# Altium project Word_Two.PrjPcb
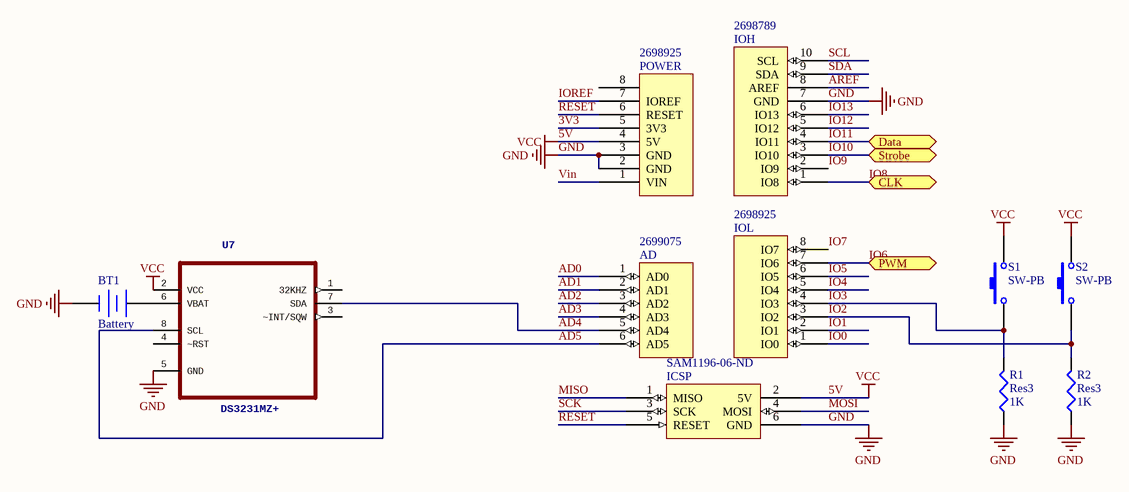
[diagram p0: ArduinoUnoShield.SchDoc]
2 sheets, 17 parts. Net scope: flat (ports and power ports of the same name join across sheets).
Board file: ArduinoUnoShield.PcbDoc
Sheets:
  ArduinoUnoShield.SchDoc
  Clock.SchDoc

## Sheet ArduinoUnoShield.SchDoc
size A4

### Parts
AD  Supplier Part Number 4: 2699075  [Header 6x1 8.5mm]  (hidden comment: AD)
BT1  Battery  [BAT-2]
ICSP  Supplier Part Number 5: SAM1196-06-ND  [ICSP]  (hidden comment: ICSP)
IOH  Supplier Part Number 3: 2698789  [Header 10x1 8.5mm]  (hidden comment: IOH)
IOL  Supplier Part Number 4: 2698925  [Header 8x1 8.5mm]  (hidden comment: IOL)
POWER  Supplier Part Number 4: 2698925  [Header 8x1 8.5mm]  (hidden comment: POWER_UNO)
R1  Res3  value 1K  [J1-0603]
R2  Res3  value 1K  [J1-0603]
S1  SW-PB  [SPST-2]
S2  SW-PB  [SPST-2]
U7  DS3231MZ+  [SOIC8_150MIL]

### Ports
CLK, Data, PWM, Strobe

### Nets
5V: ICSP.2(5V) POWER.4(5V) S1.2 S2.2 U7.2(VCC)  [also labelled VCC]
GND: BT1.2(-) ICSP.6(GND) IOH.7(GND) POWER.2(GND) POWER.3(GND) R1.1 R2.1 U7.5(GND)
3V3: POWER.5(3V3)
AD0: AD.1(AD0)
AD1: AD.2(AD1)
AD2: AD.3(AD2)
AD3: AD.4(AD3)
AD4: AD.5(AD4) U7.7(SDA)
AD5: AD.6(AD5) U7.8(SCL)
AREF: IOH.8(AREF)
IO0: IOL.1(IO0)
IO1: IOL.2(IO1)
IO2: IOL.3(IO2) R2.2 S2.1
IO3: IOL.4(IO3) R1.2 S1.1
IO4: IOL.5(IO4)
IO5: IOL.6(IO5)
IO6: IOL.7(IO6) ; port PWM
IO7: IOL.8(IO7)
IO8: IOH.1(IO8) ; port CLK
IO9: IOH.2(IO9)
IO10: IOH.3(IO10) ; port Strobe
IO11: IOH.4(IO11) ; port Data
IO12: IOH.5(IO12)
IO13: IOH.6(IO13)
IOREF: POWER.7(IOREF)
MISO: ICSP.1(MISO)
MOSI: ICSP.4(MOSI)
RESET: ICSP.5(RESET) POWER.6(RESET)
SCK: ICSP.3(SCK)
SCL: IOH.10(SCL)
SDA: IOH.9(SDA)
Vin: POWER.1(VIN)
NetBT1_1: BT1.1(+) U7.6(VBAT)

Not connected (* = marked no-connect by the designer): POWER 8; U7 1(32KHZ) 3(~INT/SQW) 4(~RST)

### Library data of the parts
BT1 = Battery: Multicell Battery; Published: 24-Mar-1999; LatestRevisionDate: 17-Jul-2002; LatestRevisionNote: Re-released for DXP Platform.; PackageReference: BAT-2; Publisher: Altium Limited; PackageDescription: Battery; 2 Leads
R1 R2 = Res3: Resistor; Published: 8-Jun-2000; LatestRevisionDate: 29-May-2009; LatestRevisionNote: IPC-7351 Footprint Added.; PackageReference: J1-0603; Publisher: Altium Limited; PackageDescription: Chip Resistor
S1 S2 = SW-PB: Switch; Published: 24-Mar-1999; LatestRevisionDate: 17-Jul-2002; LatestRevisionNote: Re-released for DXP Platform.; PackageReference: SPST-2; Publisher: Altium Limited; PackageDescription: Switch; 2 Leads
U7 = DS3231MZ+: MF: Maxim Integrated; Availability: Good; Package: SOIC-8 Maxim Integrated; Price: 5.38 USD; MP: DS3231MZ+
AD = AD: Supplier 1: Arrow; Supplier Part Number 1: 2699089; Supplier 2: Digi-Key; Supplier Part Number 2: SAM1198-06-ND; Supplier 3: Arrow; Supplier Part Number 3: 2699088; Supplier 4: Arrow
ICSP = ICSP: Supplier 1: Arrow; Supplier Part Number 1: 2699117; Supplier 2: Arrow; Supplier Part Number 2: 2699116; Supplier 3: Digi-Key; Supplier Part Number 3: SAM1185-06-ND; Supplier 4: Arrow; Supplier Part Number 4: 2699091; Supplier 5: Digi-Key
IOH = IOH: Supplier 1: Arrow; Supplier Part Number 1: 2698803S4475693N1004; Supplier 2: Digi-Key; Supplier Part Number 2: SAM1198-10-ND; Supplier 3: Arrow
IOL = IOL: Supplier 1: Digi-Key; Supplier Part Number 1: SAM1198-08-ND; Supplier 2: Arrow; Supplier Part Number 2: 2698939; Supplier 3: Arrow; Supplier Part Number 3: 2698940; Supplier 4: Arrow
POWER = POWER_UNO: Supplier 1: Digi-Key; Supplier Part Number 1: SAM1198-08-ND; Supplier 2: Arrow; Supplier Part Number 2: 2698939; Supplier 3: Arrow; Supplier Part Number 3: 2698940; Supplier 4: Arrow

## Sheet Clock.SchDoc
size A4
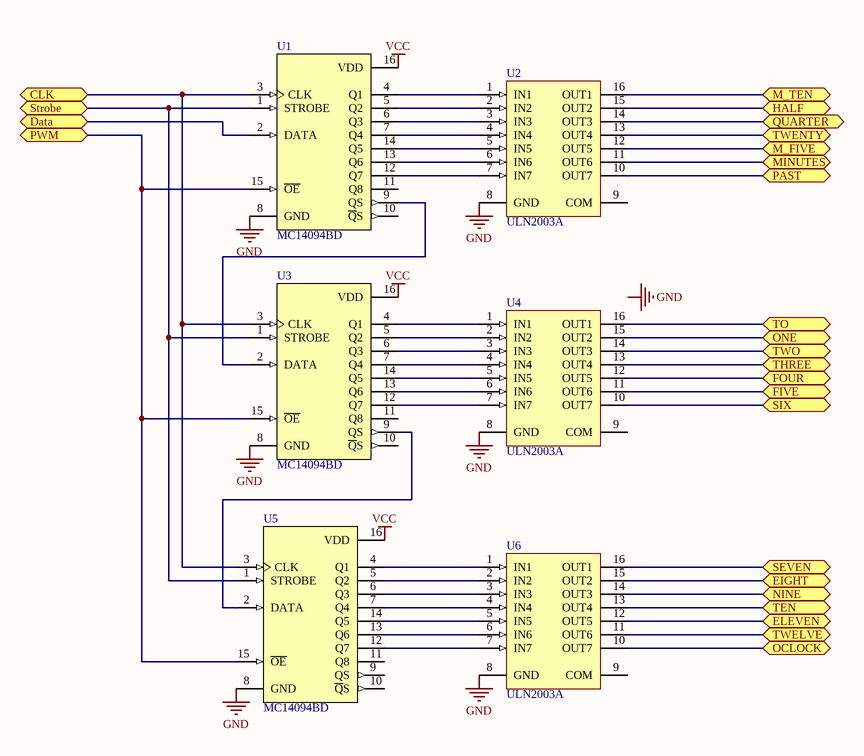
[diagram p1: Clock.SchDoc]

### Parts
U1  MC14094BD  [751B-05_N]
U2  ULN2003A  [DIP16]
U3  MC14094BD  [751B-05_N]
U4  ULN2003A  [DIP16]
U5  MC14094BD  [751B-05_N]
U6  ULN2003A  [DIP16]

### Ports
CLK, Data, EIGHT, ELEVEN, FIVE, FOUR, HALF, M_FIVE, M_TEN, MINUTES, NINE, OCLOCK, ONE, PAST, PWM, QUARTER, SEVEN, SIX, Strobe, TEN, THREE, TO, TWELVE, TWENTY, TWO

### Nets
GND: U1.8(GND) U2.8(GND) U3.8(GND) U4.8(GND) U5.8(GND) U6.8(GND)
VCC: U1.16(VDD) U3.16(VDD) U5.16(VDD)  [project net 5V]
IO6: U1.15(~{OE}) U3.15(~{OE}) U5.15(~{OE}) ; port PWM
IO8: U1.3(CLK) U3.3(CLK) U5.3(CLK) ; port CLK
IO10: U1.1(STROBE) U3.1(STROBE) U5.1(STROBE) ; port Strobe
IO11: U1.2(DATA) ; port Data
NetU1_4: U1.4(Q1) U2.1(IN1)
NetU1_5: U1.5(Q2) U2.2(IN2)
NetU1_6: U1.6(Q3) U2.3(IN3)
NetU1_7: U1.7(Q4) U2.4(IN4)
NetU1_9: U1.9(QS) U3.2(DATA)
NetU1_12: U1.12(Q7) U2.7(IN7)
NetU1_13: U1.13(Q6) U2.6(IN6)
NetU1_14: U1.14(Q5) U2.5(IN5)
NetU2_10: U2.10(OUT7) ; port PAST
NetU2_11: U2.11(OUT6) ; port MINUTES
NetU2_12: U2.12(OUT5) ; port M_FIVE
NetU2_13: U2.13(OUT4) ; port TWENTY
NetU2_14: U2.14(OUT3) ; port QUARTER
NetU2_15: U2.15(OUT2) ; port HALF
NetU2_16: U2.16(OUT1) ; port M_TEN
NetU3_4: U3.4(Q1) U4.1(IN1)
NetU3_5: U3.5(Q2) U4.2(IN2)
NetU3_6: U3.6(Q3) U4.3(IN3)
NetU3_7: U3.7(Q4) U4.4(IN4)
NetU3_9: U3.9(QS) U5.2(DATA)
NetU3_12: U3.12(Q7) U4.7(IN7)
NetU3_13: U3.13(Q6) U4.6(IN6)
NetU3_14: U3.14(Q5) U4.5(IN5)
NetU4_10: U4.10(OUT7) ; port SIX
NetU4_11: U4.11(OUT6) ; port FIVE
NetU4_12: U4.12(OUT5) ; port FOUR
NetU4_13: U4.13(OUT4) ; port THREE
NetU4_14: U4.14(OUT3) ; port TWO
NetU4_15: U4.15(OUT2) ; port ONE
NetU4_16: U4.16(OUT1) ; port TO
NetU5_4: U5.4(Q1) U6.1(IN1)
NetU5_5: U5.5(Q2) U6.2(IN2)
NetU5_6: U5.6(Q3) U6.3(IN3)
NetU5_7: U5.7(Q4) U6.4(IN4)
NetU5_12: U5.12(Q7) U6.7(IN7)
NetU5_13: U5.13(Q6) U6.6(IN6)
NetU5_14: U5.14(Q5) U6.5(IN5)
NetU6_10: U6.10(OUT7) ; port OCLOCK
NetU6_11: U6.11(OUT6) ; port TWELVE
NetU6_12: U6.12(OUT5) ; port ELEVEN
NetU6_13: U6.13(OUT4) ; port TEN
NetU6_14: U6.14(OUT3) ; port NINE
NetU6_15: U6.15(OUT2) ; port EIGHT
NetU6_16: U6.16(OUT1) ; port SEVEN

Not connected (* = marked no-connect by the designer): U1 10(~{Q}S) 11(Q8); U2 9(COM); U3 10(~{Q}S) 11(Q8); U4 9(COM); U5 9(QS) 10(~{Q}S) 11(Q8); U6 9(COM)

### Notes on the sheet
- Labels drawn without touching a wire or pin: GND

### Library data of the parts
U1 U3 U5 = MC14094BD: 8-Stage Shift/Store Register with 3-State Outputs; Published: 15-Apr-2002; LatestRevisionDate: 13-Apr-2006; LatestRevisionNote: IPC-7351 Footprint Added.; DatasheetVersion: 1995; PackageVersion: Oct-1999; PackageReference: 751B-05; Publisher: Altium Limited; PackageDescription: 16-Pin Small Outline Integrated Circuit 1.27 mm Pitch; Code_JEDEC: MS-012-AC; Code_IPC: SOIC127P600-16; ComponentLink1Description: Manufacturer Link; ComponentLink1URL: http://www.onsemi.com/; ComponentLink2Description: Datasheet; ComponentLink2URL: http://www.onsemi.com/pub/Collateral/MC14094B-D.PDF
U2 U4 U6 = ULN2003A: Seven Darlington Array; Published: 8-Jun-2000; LatestRevisionDate: 06-Jun-2005; LatestRevisionNote: Stylized 3D Model Added.; DatasheetVersion: Sep-1998; PackageVersion: Apr-1996; PackageReference: DIP16; Publisher: Altium Limited; PackageDescription: DIP; 16 Leads; Row Spacing 7.62 mm; Pitch 2.54 mm; ComponentLink1Description: Manufacturer Link; ComponentLink1URL: http://www.st.com/; ComponentLink2Description: Datasheet; ComponentLink2URL: http://www.st.com/stonline/products/literature/ds/5279/uln2001.pdf

## Nets that join several sheets
5V: ArduinoUnoShield (5 pins), Clock (U1.16 U3.16 U5.16)
GND: ArduinoUnoShield (8 pins), Clock (6 pins)
IO6: ArduinoUnoShield (IOL.7), Clock (U1.15 U3.15 U5.15)
IO8: ArduinoUnoShield (IOH.1), Clock (U1.3 U3.3 U5.3)
IO10: ArduinoUnoShield (IOH.3), Clock (U1.1 U3.1 U5.1)
IO11: ArduinoUnoShield (IOH.4), Clock (U1.2)